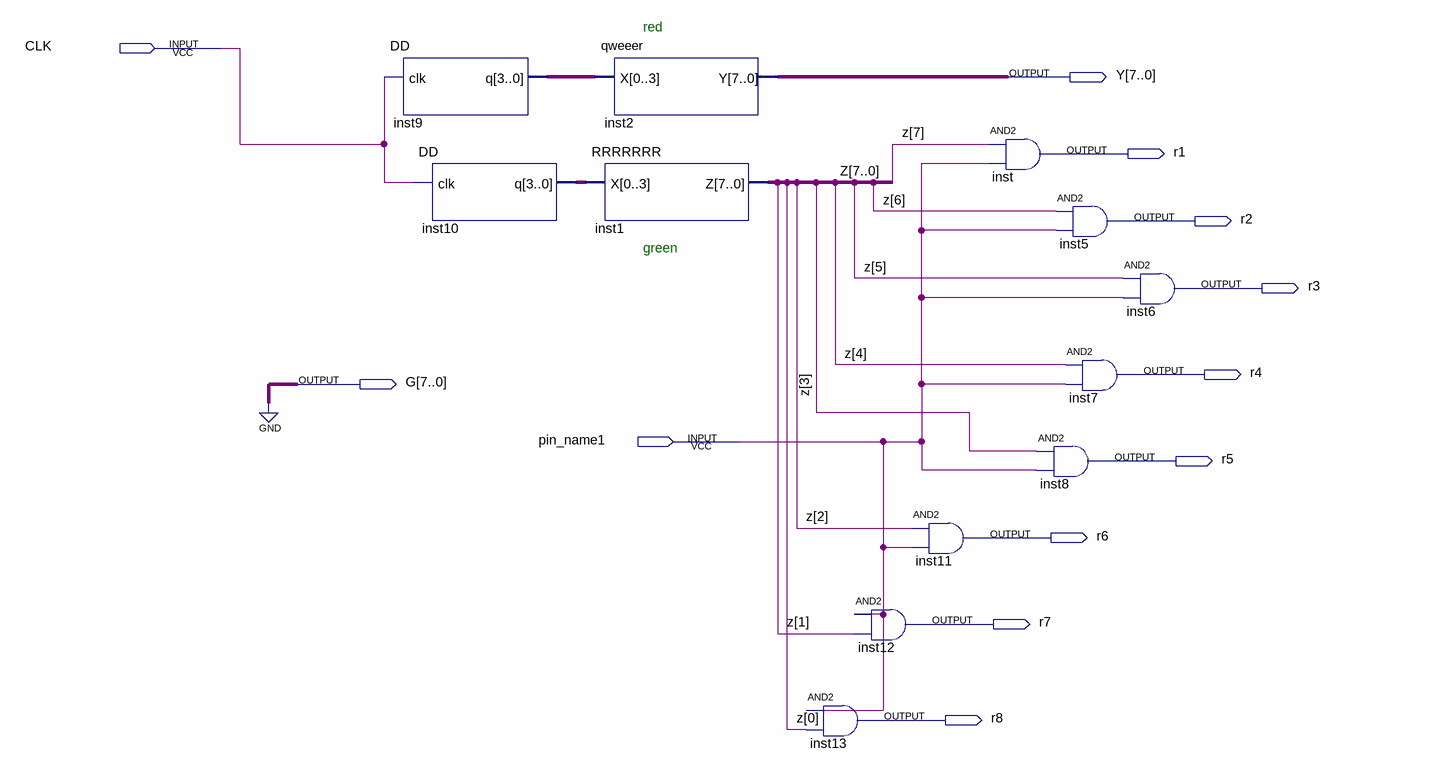
[diagram p0: schematic sheet]
// Quartus schematic 88LED.bdf as structural Verilog: 12 symbols, 12 pins
module \88LED  (
  input  CLK,
  input  pin_name1,
  output [7:0] Y,
  output r1,
  output r2,
  output r3,
  output r4,
  output [7:0] G,
  output r5,
  output r6,
  output r7,
  output r8
);

  wire [3:0] inst9_q, inst10_q;
  wire [7:0] z;

  DD inst9 (.clk(CLK), .q(inst9_q));
  DD inst10 (.clk(CLK), .q(inst10_q));
  qweeer inst2 (.X(inst9_q), .Y(Y));
  RRRRRRR inst1 (.X(inst10_q), .Z(z));
  and inst13 (r8, pin_name1, z[0]);
  and inst11 (r6, z[2], pin_name1);
  and inst12 (r7, pin_name1, z[1]);
  and inst (r1, z[7], pin_name1);
  and inst5 (r2, z[6], pin_name1);
  and inst7 (r4, z[4], pin_name1);
  and inst8 (r5, z[3], pin_name1);
  and inst6 (r3, z[5], pin_name1);

  assign G = {8{1'b0}};

  // Notes on the sheet:
  //   red
  //   green
endmodule
